# Altium schematic sheet power.SchDoc
size A4
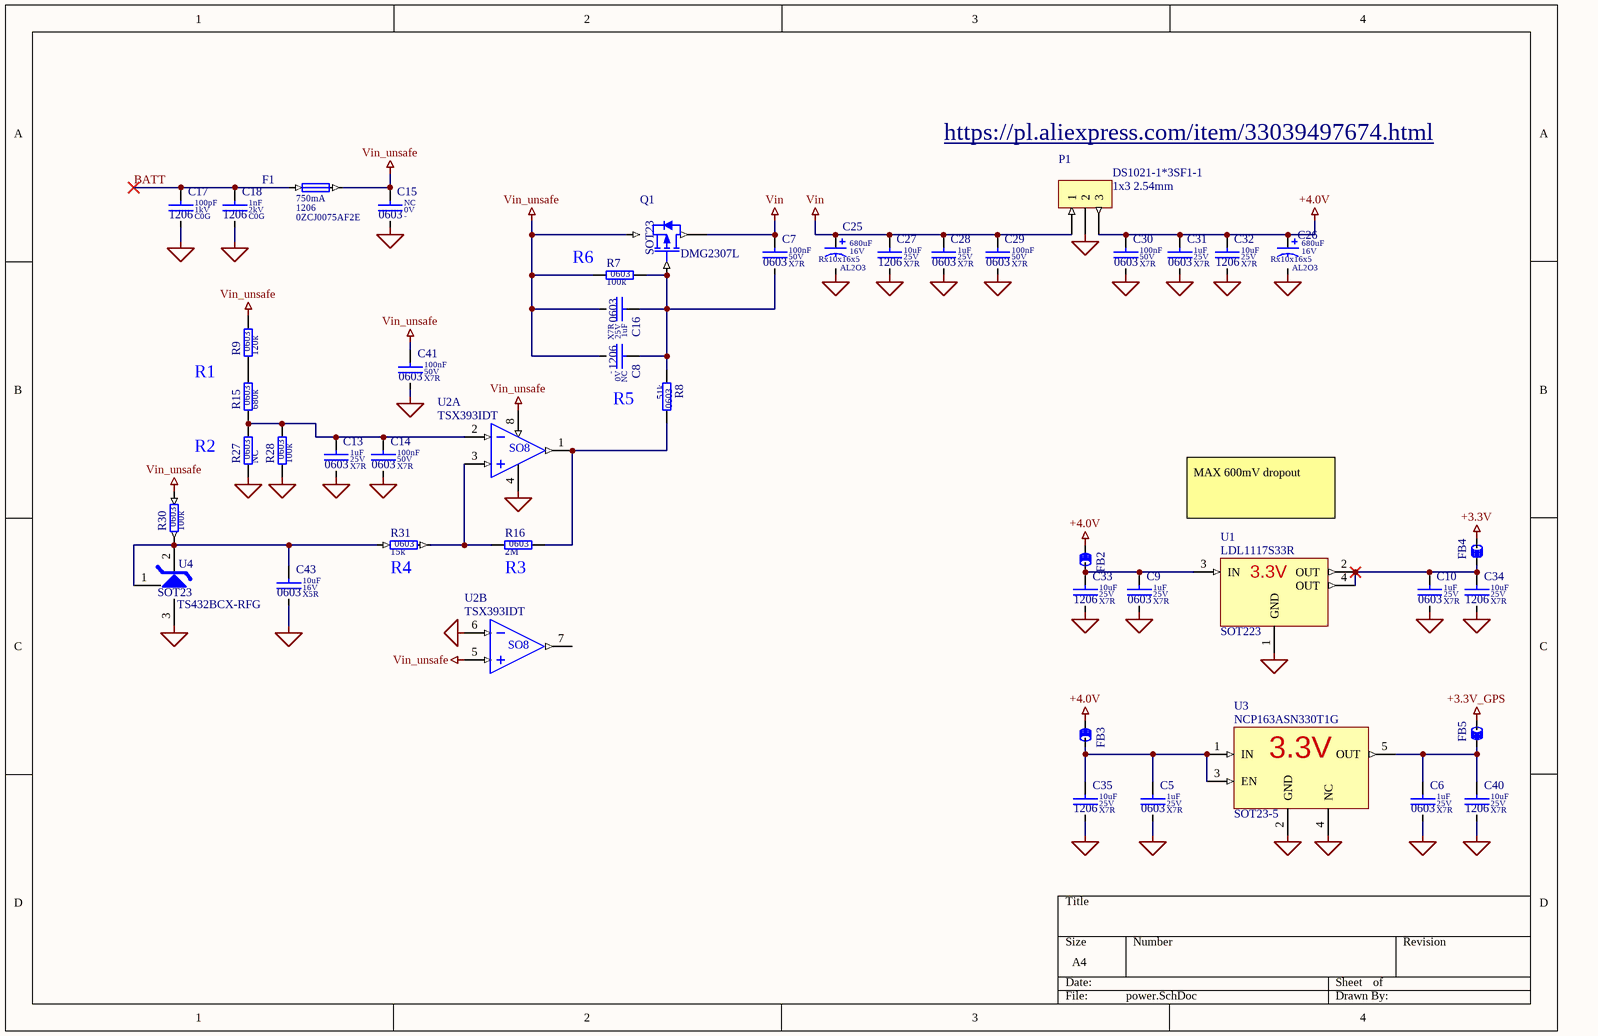
[diagram p0: power.SchDoc]

## Parts
C5  value 1uF  Dielectric: X7R  Voltage: 25V  SCH_Footprint: 0603  [C_0603_1608]  (hidden comment: Ceramic X7R)
C6  value 1uF  Dielectric: X7R  Voltage: 25V  SCH_Footprint: 0603  [C_0603_1608]  (hidden comment: Ceramic X7R)
C7  value 100nF  Dielectric: X7R  Voltage: 50V  SCH_Footprint: 0603  [C_0603_1608]  (hidden comment: Ceramic X7R)
C8  value NC  Voltage: 0V  SCH_Footprint: 1206  [C_NC_1206_3216]  (hidden comment: -)
C9  value 1uF  Dielectric: X7R  Voltage: 25V  SCH_Footprint: 0603  [C_0603_1608]  (hidden comment: Ceramic X7R)
C10  value 1uF  Dielectric: X7R  Voltage: 25V  SCH_Footprint: 0603  [C_0603_1608]  (hidden comment: Ceramic X7R)
C13  value 1uF  Dielectric: X7R  Voltage: 25V  SCH_Footprint: 0603  [C_0603_1608]  (hidden comment: Ceramic X7R)
C14  value 100nF  Dielectric: X7R  Voltage: 50V  SCH_Footprint: 0603  [C_0603_1608]  (hidden comment: Ceramic X7R)
C15  value NC  Voltage: 0V  SCH_Footprint: 0603  [C_NC_0603_1608]  (hidden comment: -)
C16  value 1uF  Dielectric: X7R  Voltage: 25V  SCH_Footprint: 0603  [C_0603_1608]  (hidden comment: Ceramic X7R)
C17  value 100pF  Dielectric: C0G  Voltage: 1kV  SCH_Footprint: 1206  [C_1206_3216]  (hidden comment: Ceramic C0G)
C18  value 1nF  Dielectric: C0G  Voltage: 2kV  SCH_Footprint: 1206  [C_1206_3216]  (hidden comment: Ceramic C0G)
C25  value 680uF  Dielectric: AL2O3  SCH_Footprint: Rx10x16x5  Voltage: 16V  [C_10x16x5]  (hidden comment: Electrolytic Capacitor)
C26  value 680uF  Dielectric: AL2O3  SCH_Footprint: Rx10x16x5  Voltage: 16V  [C_10x16x5]  (hidden comment: Electrolytic Capacitor)
C27  value 10uF  Dielectric: X7R  Voltage: 25V  SCH_Footprint: 1206  [C_1206_3216]  (hidden comment: Ceramic X7R)
C28  value 1uF  Dielectric: X7R  Voltage: 25V  SCH_Footprint: 0603  [C_0603_1608]  (hidden comment: Ceramic X7R)
C29  value 100nF  Dielectric: X7R  Voltage: 50V  SCH_Footprint: 0603  [C_0603_1608]  (hidden comment: Ceramic X7R)
C30  value 100nF  Dielectric: X7R  Voltage: 50V  SCH_Footprint: 0603  [C_0603_1608]  (hidden comment: Ceramic X7R)
C31  value 1uF  Dielectric: X7R  Voltage: 25V  SCH_Footprint: 0603  [C_0603_1608]  (hidden comment: Ceramic X7R)
C32  value 10uF  Dielectric: X7R  Voltage: 25V  SCH_Footprint: 1206  [C_1206_3216]  (hidden comment: Ceramic X7R)
C33  value 10uF  Dielectric: X7R  Voltage: 25V  SCH_Footprint: 1206  [C_1206_3216]  (hidden comment: Ceramic X7R)
C34  value 10uF  Dielectric: X7R  Voltage: 25V  SCH_Footprint: 1206  [C_1206_3216]  (hidden comment: Ceramic X7R)
C35  value 10uF  Dielectric: X7R  Voltage: 25V  SCH_Footprint: 1206  [C_1206_3216]  (hidden comment: Ceramic X7R)
C40  value 10uF  Dielectric: X7R  Voltage: 25V  SCH_Footprint: 1206  [C_1206_3216]  (hidden comment: Ceramic X7R)
C41  value 100nF  Dielectric: X7R  Voltage: 50V  SCH_Footprint: 0603  [C_0603_1608]  (hidden comment: Ceramic X7R)
C43  value 10uF  Dielectric: X5R  Voltage: 16V  SCH_Footprint: 0603  [C_0603_1608]  (hidden comment: Ceramic X5R)
F1  value 0ZCJ0075AF2E  SCH_Footprint: 1206  Current: 750mA  [F_1206_3216]  (hidden comment: Fuse)
FB2  Ferrite bead  [FB_0603_1608]  (value not drawn)
FB3  Ferrite bead  [FB_0603_1608]  (value not drawn)
FB4  Ferrite bead  [FB_0603_1608]  (value not drawn)
FB5  Ferrite bead  [FB_0603_1608]  (value not drawn)
P1  value DS1021-1*3SF1-1  SCH_Footprint: 1x3 2.54mm  [P_HEADER_1x3_2.54]  (hidden comment: Goldpin)
Q1  DMG2307L  [SOT23_TO236_SC59]
R7  value 100k  SCH_Footprint: 0603  [R_0603_1608]  (hidden comment: Resistor)
R8  value 51k  SCH_Footprint: 0603  [R_0603_1608]  (hidden comment: Resistor)
R9  value 120k  SCH_Footprint: 0603  [R_0603_1608]  (hidden comment: Resistor)
R15  value 680k  SCH_Footprint: 0603  [R_0603_1608]  (hidden comment: Resistor)
R16  value 2M  SCH_Footprint: 0603  [R_0603_1608]  (hidden comment: Resistor)
R27  value NC  SCH_Footprint: 0603  [R_NC_0603_1608]  (hidden comment: Resistor)
R28  value 100k  SCH_Footprint: 0603  [R_0603_1608]  (hidden comment: Resistor)
R30  value 100k  SCH_Footprint: 0603  [R_0603_1608]  (hidden comment: Resistor)
R31  value 15k  SCH_Footprint: 0603  [R_0603_1608]  (hidden comment: Resistor)
U1  SCH_Footprint: SOT223  [SOT223_SC73]  (hidden comment: LDL1117S33R)
U2  TSX393IDT  [SOP8_SO8_SOIC8_4X5X18]  (parts A,B of 2)
U3  value NCP163ASN330T1G  SCH_Footprint: SOT23-5  [SOT23-5_SC74A_SOT753_M]  (hidden comment: RF LDO)
U4  value TS432BCX-RFG  SCH_Footprint: SOT23  [SOT23_TO236_SC59]  (hidden comment: Precision Shunt Regulator Reference)

## Nets
+3.3V: FB4.2
+3.3V_GPS: FB5.2
+4.0V: C26.1 C30.1 C31.1 C32.1 FB2.1 FB3.1 P1.3
GND: C5.2 C6.2 C9.2 C10.2 C13.2 C14.2 C15.2 C17.2 C18.2 C25.2 C26.2 C27.2 C28.2 C29.2 C30.2 C31.2 C32.2 C33.2 C34.2 C35.2 C40.2 C41.2 C43.2 P1.2 R27.1 R28.1 U1.1(GND) U2.4(GND) U2.6(IN-2) U3.2(GND) U3.4(NC) U4.3
Vin: C7.1 C25.1 C27.1 C28.1 C29.1 P1.1 Q1.3(D)
Vin_unsafe: C8.2 C15.1 C16.2 C41.1 F1.2 Q1.2(S) R7.1 R9.2 R30.2 U2.5(IN+2) U2.8(VDD)
BATT: C17.1 C18.1 F1.1
NetC5_1: C5.1 C35.1 FB3.2 U3.1(IN) U3.3(EN)
NetC6_1: C6.1 C40.1 FB5.1 U3.5(OUT)
NetC7_2: C7.2 C8.1 C16.1 Q1.1(G) R7.2 R8.1
NetC9_1: C9.1 C33.1 FB2.2 U1.3(IN)
NetC10_1: C10.1 C34.1 FB4.1 U1.2(OUT) U1.4(OUT)
NetC13_1: C13.1 C14.1 R15.1 R27.2 R28.2 U2.2(IN-1)
NetC43_1: C43.1 R30.1 R31.1 U4.1 U4.2
NetR8_2: R8.2 R16.2 U2.1(OUT1)
NetR9_1: R9.1 R15.2
NetR16_1: R16.1 R31.2 U2.3(IN+1)

Not connected (* = marked no-connect by the designer): U2 7(OUT2)

## Notes on the sheet
- https://pl.aliexpress.com/item/33039497674.html
- (near R7) R6
- R1
- R5
- R2
- MAX 600mV dropout
- (near R31) R4
- (near R16) R3
- (in symbol A2_TSX393IDT, part A) SO8
- (in symbol A2_TSX393IDT, part B) SO8

## Library data of the parts
C5 C6 C9 C10 C13 C16 C28 C31 = C_1uF_25V_X7R_0603_10: Capacitor; Manufacturer: Samsung; Manufacturer Part Number: CL10B105KA8NNNC; Tolerance (%): 10; Part Number: C_1uF_25V_X7R_0603_10; HelpURL: http://www.tme.eu/pl/Document/4a42202b32dab16128fe107dd69598cc/samsung-chip-cap.pdf; Supplier 1: TME; Supplier Part Number 1: CL10B105KA8NNNC; Supplier 2: RS Components; Supplier 3: Farnell; Supplier 4: Mouser; Supplier 5: Digi-Key; Supplier 6: LCSC
C7 C14 C29 C30 C41 = C_100nF_50V_X7R_0603_5: Capacitor; Manufacturer: Samsung; Manufacturer Part Number: CL10B104JB8NNNC; Tolerance (%): 5; Part Number: C_100nF_50V_X7R_0603_5; HelpURL: http://www.tme.eu/pl/Document/4a42202b32dab16128fe107dd69598cc/samsung-chip-cap.pdf; Supplier 1: TME; Supplier Part Number 1: CL10B104JB8NNNC; Supplier 2: RS Components; Supplier Part Number 2: 7665455; Supplier 3: Farnell; Supplier 4: Mouser; Supplier 5: Digi-Key; Supplier Part Number 5: 1276-1033-1-ND; Supplier 6: LCSC; Supplier Part Number 6: C24452
C8 = C_GENERIC_1206: Capacitor; Tolerance (%): 0; Dielectric: -; Part Number: C_GENERIC_1206; HelpURL: http://-; Manufacturer: -; Manufacturer Part Number: -; Supplier 1: TME; Supplier 2: RS Components; Supplier 3: Farnell; Supplier 4: Mouser; Supplier 5: Digi-Key; Supplier 6: LCSC
C15 = C_GENERIC_0603: Capacitor; Tolerance (%): 0; Dielectric: -; Part Number: C_GENERIC_0603; HelpURL: http://-; Manufacturer: -; Manufacturer Part Number: -; Supplier 1: TME; Supplier 2: RS Components; Supplier 3: Farnell; Supplier 4: Mouser; Supplier 5: Digi-Key; Supplier 6: LCSC
C17 = C_100pF_1kV_C0G_1206_10: Capacitor; Manufacturer: Kemet; Manufacturer Part Number: C1206C101KDGACAUTO; Tolerance (%): 10; Part Number: C_100pF_1kV_C0G_1206_10; HelpURL: https://datasheet.octopart.com/C1206C101KDGACAUTO-KEMET-datasheet-104412918.pdf; Supplier 1: TME; Supplier 2: RS Components; Supplier 3: Farnell; Supplier Part Number 3: 2834494; Supplier 4: Mouser; Supplier Part Number 4: 80-C1206C101KDGAUTO; Supplier 5: Digi-Key; Supplier Part Number 5: 399-16668-1-ND; Supplier 6: LCSC; Supplier Part Number 6: C561839
C18 = C_1nF_2kV_C0G_1206_10: Capacitor; Manufacturer: AVX; Manufacturer Part Number: 1206GC102KAT1A; Tolerance (%): 10; Part Number: C_1nF_2kV_C0G_1206_10; HelpURL: http://www.tme.eu/pl/Document/667fe6e7748c0ed1675574c6bf64b751/AVX_X7R.pdf; Supplier 1: TME; Supplier Part Number 1: 1206GC102KAT1A; Supplier 2: RS Components; Supplier 3: Farnell; Supplier 4: Mouser; Supplier 5: Digi-Key; Supplier 6: LCSC
C25 C26 = CE_680uF_16V_10x16x5_LESR_20: Polarized Capacitor; Manufacturer: Panasonic; Manufacturer Part Number: EEUFC1C681; Tolerance (%): 20; Part Number: CE_680uF_16V_10x16x5_LESR_20; HelpURL: http://www.tme.eu/pl/Document/03efc9a050846e2e56a9cbbb3a5dd471/EEUFC0J221.pdf; Supplier 1: TME; Supplier Part Number 1: EEUFC1C681; Supplier 2: RS Components; Supplier 3: Farnell; Supplier 4: Mouser; Supplier 5: Digi-Key; Supplier 6: LCSC
C27 C32-C35 C40 = C_10uF_25V_X7R_1206_10: Capacitor; Manufacturer: Samsung Electro-Mechanics; Manufacturer Part Number: CL31B106KAHNNNE; Tolerance (%): 10; Part Number: C_10uF_25V_X7R_1206_10; HelpURL: http://www.tme.eu/pl/Document/4a42202b32dab16128fe107dd69598cc/samsung-chip-cap.pdf; Supplier 1: TME; Supplier Part Number 1: CL31B106KAHNNNE; Supplier 2: RS Components; Supplier 3: Farnell; Supplier 4: Mouser; Supplier 5: Digi-Key; Supplier 6: LCSC
C43 = C_10uF_16V_X5R_0603_20: Capacitor; Manufacturer: Samsung; Manufacturer Part Number: CL10A106MO8NQNC; Tolerance (%): 20; Part Number: C_10uF_16V_X5R_0603_20; HelpURL: http://www.tme.eu/pl/Document/4a42202b32dab16128fe107dd69598cc/samsung-chip-cap.pdf; Supplier 1: TME; Supplier Part Number 1: CL10A106MO8NQNC; Supplier 2: RS Components; Supplier 3: Farnell; Supplier 4: Mouser; Supplier Part Number 4: 187-CL10A106MO8NQNC; Supplier 5: Digi-Key; Supplier Part Number 5: 1276-1870-1-ND; Supplier 6: LCSC
F1 = F_750mA_16V_1206: Manufacturer: BEL Fuse; Voltage: 16V; Part Number: F_750mA_16V_1206; HelpURL: https://www.tme.eu/pl/Document/ede4b57335e236a1cff0dbc703b28c62/0ZCJ-DTE.pdf; Manufacturer Part Number: 0ZCJ0075AF2E; Supplier 1: TME; Supplier Part Number 1: 0ZCJ0075AF2E; Supplier 2: RS Components; Supplier 3: Farnell; Supplier Part Number 3: 2834890; Supplier 4: Mouser; Supplier Part Number 4: 530-0ZCJ0075AF2E; Supplier 5: Digi-Key; Supplier Part Number 5: 507-1805-1-ND; Supplier 6: LCSC
FB2-FB5 = FB_BLM18AG601SN1: Manufacturer: Murata; Manufacturer Part Number: BLM18AG601SN1D; SCH_Footprint: 0603; Current: 500mA; Resistance: 600R; Part Number: FB_BLM18AG601SN1; Value: BLM18AG601SN1; HelpURL: http://datasheet.octopart.com/BLM18AG601SN1D-Murata-datasheet-11743096.pdf; Supplier 1: TME; Supplier Part Number 1: BLM18AG601SN1D; Supplier 2: RS Components; Supplier Part Number 2: 7241299P; Supplier 3: Farnell; Supplier Part Number 3: 1515679; Supplier 4: Mouser; Supplier Part Number 4: 81-BLM11A601S; Supplier 5: Digi-Key; Supplier Part Number 5: 490-1014-1-ND; Supplier 6: LCSC
P1 = P_HEADER_1x3_2.54: Pin Header; Manufacturer: Connfly; Part Number: P_HEADER_1x3_2.54; HelpURL: http://www.tme.eu/en/Document/cc301e58a5da78cb543a94b5a5b7f06a/DS1021.pdf; Manufacturer Part Number: DS1021-1*3SF1-1; Supplier 1: TME; Supplier Part Number 1: ZL201-03G; Supplier 2: RS Components; Supplier 3: Farnell; Supplier 4: Mouser; Supplier 5: Digi-Key; Supplier 6: LCSC
Q1 = QP_DMG2307L: Manufacturer: Diodes Inc; SCH_Footprint: SOT23; Type: P-MOS; Voltage: 30; Current: 3A; Part Number: QP_DMG2307L; Value: DMG2307L; HelpURL: https://www.diodes.com/assets/Datasheets/DMG2307L.pdf; Manufacturer Part Number: DMG2307L; Supplier 1: TME; Supplier Part Number 1: DMG2307L-7; Supplier 2: RS Components; Supplier Part Number 2: 8222539; Supplier 3: Farnell; Supplier Part Number 3: 3127316; Supplier 4: Mouser; Supplier Part Number 4: 621-DMG2307L-7; Supplier 5: Digi-Key; Supplier Part Number 5: DMG2307L-7DICT-ND; Supplier 6: LCSC
R7 R28 R30 = R_100k_0603_1: Manufacturer: Royalohm; Manufacturer Part Number: 0603SAF1003T5E; Voltage: 50V; Power: 100mW; Tolerance: 1%; Part Number: R_100k_0603_1; HelpURL: http://www.tme.eu/pl/Document/b315665a56acbc42df513c99b390ad98/ROYALOHM-THICKFILM.pdf; Supplier 1: TME; Supplier Part Number 1: SMD0603-100K-1%; Supplier 2: RS Components; Supplier 3: Farnell; Supplier 4: Mouser; Supplier Part Number 4: 667-ERJ-3EKF1003V; Supplier 5: Digi-Key; Supplier Part Number 5: P100KHCT-ND; Supplier 6: LCSC
R8 = R_51k_0603_1: Manufacturer: Royalohm; Manufacturer Part Number: 0603SAF5102T5E; Voltage: 50V; Power: 100mW; Tolerance: 1%; Part Number: R_51k_0603_1; HelpURL: https://www.tme.eu/Document/9e42ba54d36a9bd3dfa2901986ac022d/rezystor-smd.pdf; Supplier 1: TME; Supplier Part Number 1: SMD0603-51K-1%; Supplier 2: RS Components; Supplier 3: Farnell; Supplier 4: Mouser; Supplier 5: Digi-Key; Supplier 6: LCSC
R9 = R_120k_0603_1: Manufacturer: Vishay; Manufacturer Part Number: CRCW0603120KFKEA; Voltage: 75V; Power: 100mW; Tolerance: 1%; Part Number: R_120k_0603_1; HelpURL: https://datasheet.octopart.com/CRCW0603120KFKEA-Vishay-datasheet-62317933.pdf; Supplier 1: TME; Supplier 2: RS Components; Supplier Part Number 2: 6789715; Supplier 3: Farnell; Supplier Part Number 3: 2138506; Supplier 4: Mouser; Supplier Part Number 4: 71-CRCW0603-120K-E3; Supplier 5: Digi-Key; Supplier Part Number 5: 541-120KHCT-ND; Supplier 6: LCSC
R15 = R_680k_0603_1: Manufacturer: Vishay; Manufacturer Part Number: CRCW0603680KFKTABC; Voltage: 75V; Power: 100mW; Tolerance: 1%; Part Number: R_680k_0603_1; HelpURL: https://www.tme.eu/pl/Document/622e28308c06d160637f2b14751ba16b/Data%20Sheet%20CRCW_BCe3.pdf; Supplier 1: TME; Supplier Part Number 1: CRCW0603680KFKTABC; Supplier 2: RS Components; Supplier 3: Farnell; Supplier 4: Mouser; Supplier Part Number 4: 71-CRCW0603-680K; Supplier 5: Digi-Key; Supplier 6: LCSC
R16 = R_2M_0603_1: Manufacturer: Panasonic; Manufacturer Part Number: ERJ-3EKF2004V; Voltage: 75V; Power: 100mW; Tolerance: 1%; Part Number: R_2M_0603_1; HelpURL: https://datasheet.octopart.com/ERJ-3EKF2004V-Panasonic-datasheet-13266541.pdf; Supplier 1: TME; Supplier 2: RS Components; Supplier 3: Farnell; Supplier Part Number 3: 2797362; Supplier 4: Mouser; Supplier Part Number 4: 667-ERJ-3EKF2004V; Supplier 5: Digi-Key; Supplier Part Number 5: P2.00MHCT-ND; Supplier 6: LCSC
R27 = R_GENERIC_0603: Part Number: R_GENERIC_0603; Supplier 1: TME; Supplier 2: RS Components; Supplier 3: Farnell; Supplier 4: Mouser; Supplier 5: Digi-Key; Supplier 6: LCSC
R31 = R_15k_0603_1: Manufacturer: Yageo; Manufacturer Part Number: RC0603FR-0715KL; Voltage: 50V; Power: 100mW; Tolerance: 1%; Part Number: R_15k_0603_1; HelpURL: http://www.tme.eu/pl/Document/d2a72e545e5c8eb7bf2a04fa97535928/rc0603yageo.pdf; Supplier 1: TME; Supplier Part Number 1: RC0603FR-0715K; Supplier 2: RS Components; Supplier 3: Farnell; Supplier Part Number 3: 2413677; Supplier 4: Mouser; Supplier Part Number 4: 603-RC0603FR-0715KL; Supplier 5: Digi-Key; Supplier Part Number 5: 311-15.0KHRCT-ND; Supplier 6: LCSC
U1 = VL_LDL1117S33R: typical configuration; Manufacturer: STMicroelectronics; Voltage: 3.3V; Current: 1.2A; Value: LDL1117S33R; Part Number: VL_LDL1117S33R; HelpURL: https://www.st.com/resource/en/datasheet/ldl1117.pdf; Manufacturer Part Number: LDL1117S33R; Supplier 1: TME; Supplier Part Number 1: LDL1117S33R; Supplier 2: RS Components; Supplier 3: Farnell; Supplier Part Number 3: 2729708; Supplier 4: Mouser; Supplier Part Number 4: 511-LDL1117S33R; Supplier 5: Digi-Key; Supplier Part Number 5: 497-17239-1-ND; Supplier 6: LCSC
U2 = A2_TSX393IDT: Manufacturer: STMicroelectronics; SCH_Footprint: SO-8; Value: TSX393IDT; Part Number: A2_TSX393IDT; HelpURL: https://www.st.com/resource/en/datasheet/tsx393.pdf; Manufacturer Part Number: TSX393IDT; Supplier 1: TME; Supplier Part Number 1: TSX393IDT; Supplier 2: RS Components; Supplier 3: Farnell; Supplier 4: Mouser; Supplier Part Number 4: 511-TSX393IDT; Supplier 5: Digi-Key; Supplier Part Number 5: 497-16707-1-ND; Supplier 6: LCSC
U3 = VL_NCP163ASN330T1G: typical SOT23 configuration; Manufacturer: ON Semiconductor; Voltage: 3.3V; Current: 250mA; Part Number: VL_NCP163ASN330T1G; HelpURL: https://www.onsemi.com/pub/Collateral/NCP163-D.PDF; Manufacturer Part Number: NCP163ASN330T1G; Supplier 1: TME; Supplier 2: RS Components; Supplier Part Number 2: 189-0394; Supplier 3: Farnell; Supplier Part Number 3: 3131477; Supplier 4: Mouser; Supplier Part Number 4: 863-NCP163ASN330T1G; Supplier 5: Digi-Key; Supplier Part Number 5: NCP163ASN330T1GOSCT-ND; Supplier 6: LCSC
U4 = U_TS432BCX-RFG: U_TS432_3pin; Manufacturer: Taiwan Semiconductor; Part Number: U_TS432BCX-RFG; HelpURL: https://datasheet.octopart.com/TS432BCX-RFG-Taiwan-Semiconductor-datasheet-38881079.pdf; Manufacturer Part Number: TS432BCX-RFG; Supplier 1: TME; Supplier Part Number 1: TS432BCX-RFG; Supplier 2: RS Components; Supplier 3: Farnell; Supplier 4: Mouser; Supplier 5: Digi-Key; Supplier Part Number 5: TS432BCX RFG; Supplier 6: LCSC